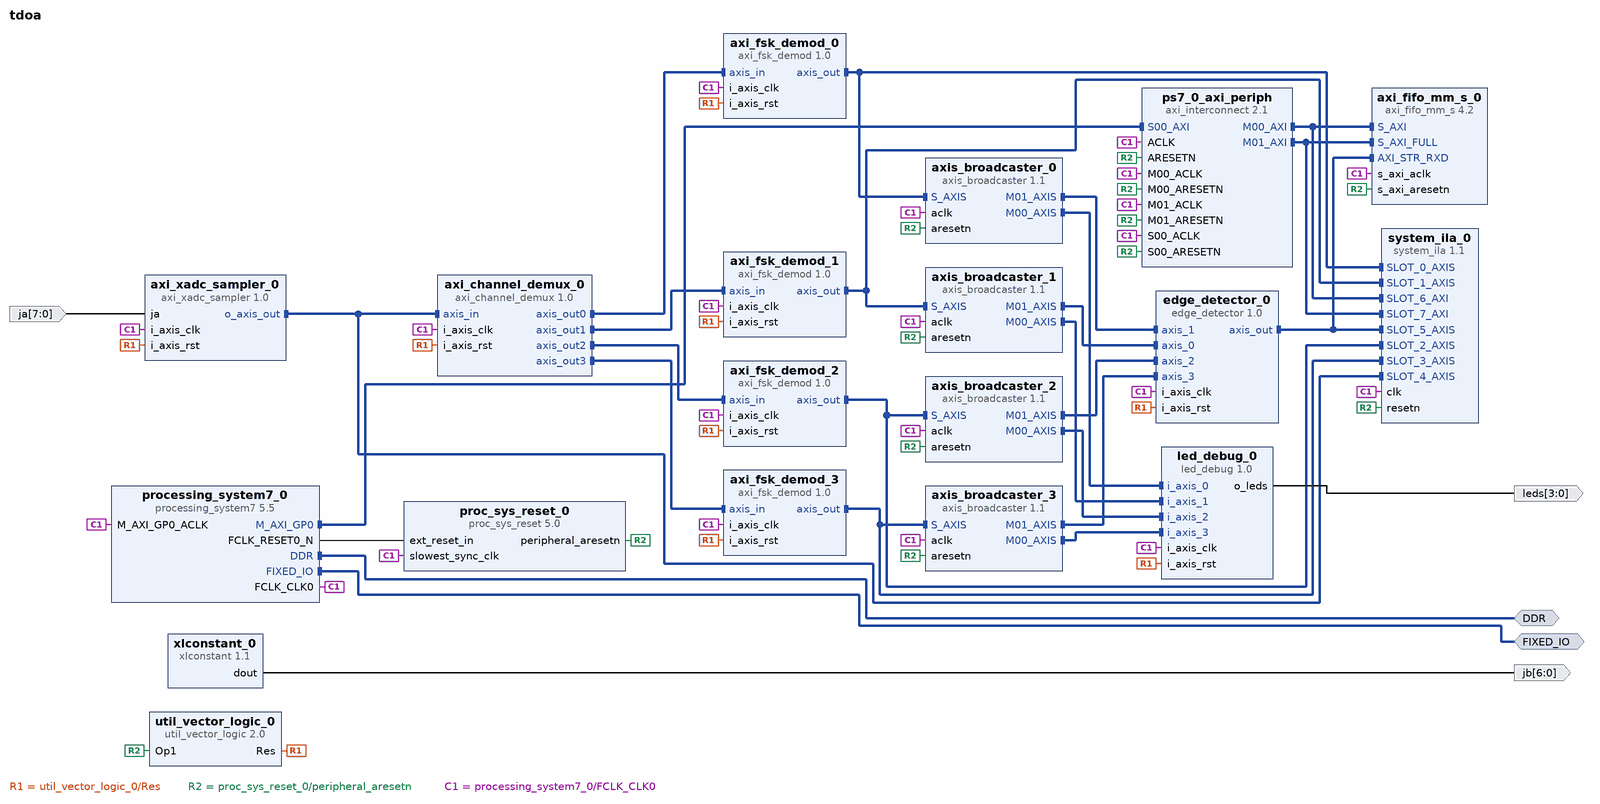
[diagram p0: block diagram of the top level]
# Vivado block design tdoa, xc7z020clg400-1, Vivado 2022.2
create_bd_design tdoa

create_bd_intf_port -mode Master -vlnv xilinx.com:interface:ddrx_rtl:1.0 DDR
create_bd_intf_port -mode Master -vlnv xilinx.com:display_processing_system7:fixedio_rtl:1.0 FIXED_IO
create_bd_port -dir I -from 7 -to 0 ja
create_bd_port -dir O -from 3 -to 0 leds
create_bd_port -dir O -from 6 -to 0 jb

create_bd_cell -type ip -vlnv xilinx.com:ip:processing_system7:5.5 processing_system7_0
set_property -dict [list \
  CONFIG.PCW_APU_PERIPHERAL_FREQMHZ 667 \
  CONFIG.PCW_ENET0_ENET0_IO {MIO 16 .. 27} \
  CONFIG.PCW_ENET0_GRP_MDIO_ENABLE 1 \
  CONFIG.PCW_ENET0_GRP_MDIO_IO {MIO 52 .. 53} \
  CONFIG.PCW_ENET0_PERIPHERAL_ENABLE 1 \
  CONFIG.PCW_ENET0_RESET_ENABLE 0 \
  CONFIG.PCW_ENET_RESET_ENABLE 1 \
  CONFIG.PCW_ENET_RESET_SELECT {Share reset pin} \
  CONFIG.PCW_FPGA0_PERIPHERAL_FREQMHZ 100 \
  CONFIG.PCW_GPIO_MIO_GPIO_ENABLE 1 \
  CONFIG.PCW_GPIO_MIO_GPIO_IO MIO \
  CONFIG.PCW_I2C_RESET_ENABLE 1 \
  CONFIG.PCW_IRQ_F2P_INTR 1 \
  CONFIG.PCW_PRESET_BANK1_VOLTAGE {LVCMOS 1.8V} \
  CONFIG.PCW_QSPI_GRP_FBCLK_ENABLE 1 \
  CONFIG.PCW_QSPI_GRP_FBCLK_IO {MIO 8} \
  CONFIG.PCW_QSPI_GRP_SINGLE_SS_ENABLE 1 \
  CONFIG.PCW_QSPI_GRP_SINGLE_SS_IO {MIO 1 .. 6} \
  CONFIG.PCW_QSPI_PERIPHERAL_ENABLE 1 \
  CONFIG.PCW_QSPI_QSPI_IO {MIO 1 .. 6} \
  CONFIG.PCW_SD0_GRP_CD_ENABLE 1 \
  CONFIG.PCW_SD0_GRP_CD_IO {MIO 47} \
  CONFIG.PCW_SD0_GRP_WP_ENABLE 0 \
  CONFIG.PCW_SD0_PERIPHERAL_ENABLE 1 \
  CONFIG.PCW_SD0_SD0_IO {MIO 40 .. 45} \
  CONFIG.PCW_SDIO_PERIPHERAL_FREQMHZ 50 \
  CONFIG.PCW_SINGLE_QSPI_DATA_MODE x4 \
  CONFIG.PCW_UART1_PERIPHERAL_ENABLE 1 \
  CONFIG.PCW_UART1_UART1_IO {MIO 48 .. 49} \
  CONFIG.PCW_UART_PERIPHERAL_FREQMHZ 100 \
  CONFIG.PCW_UIPARAM_DDR_FREQ_MHZ 533.333333 \
  CONFIG.PCW_UIPARAM_DDR_MEMORY_TYPE {DDR 3 (Low Voltage)} \
  CONFIG.PCW_UIPARAM_DDR_PARTNO {MT41K256M16 RE-125} \
  CONFIG.PCW_USB0_PERIPHERAL_ENABLE 1 \
  CONFIG.PCW_USB0_RESET_ENABLE 1 \
  CONFIG.PCW_USB0_RESET_IO {MIO 46} \
  CONFIG.PCW_USB0_USB0_IO {MIO 28 .. 39} \
  CONFIG.PCW_USB_RESET_ENABLE 1 \
  CONFIG.PCW_USB_RESET_SELECT {Share reset pin} \
  CONFIG.PCW_USE_FABRIC_INTERRUPT 1 \
] [get_bd_cells processing_system7_0]
# 296 more settings of processing_system7_0 are not shown: defaults, MIO pin electricals, DDR timing, and values the tool derives
create_bd_cell -type ip -vlnv user.org:user:axi_channel_demux:1.0 axi_channel_demux_0
create_bd_cell -type ip -vlnv xilinx.com:ip:util_vector_logic:2.0 util_vector_logic_0
set_property -dict {CONFIG.C_OPERATION not CONFIG.C_SIZE 1} [get_bd_cells util_vector_logic_0]
create_bd_cell -type ip -vlnv xilinx.com:ip:proc_sys_reset:5.0 proc_sys_reset_0
create_bd_cell -type ip -vlnv user.org:user:axi_xadc_sampler:1.0 axi_xadc_sampler_0
create_bd_cell -type ip -vlnv xilinx.com:ip:axis_broadcaster:1.1 axis_broadcaster_0
create_bd_cell -type ip -vlnv xilinx.com:ip:axi_fifo_mm_s:4.2 axi_fifo_mm_s_0
set_property -dict [list \
  CONFIG.C_AXIS_TUSER_WIDTH 4 \
  CONFIG.C_DATA_INTERFACE_TYPE 1 \
  CONFIG.C_HAS_AXIS_TDEST false \
  CONFIG.C_RX_FIFO_DEPTH 4096 \
  CONFIG.C_RX_FIFO_PE_THRESHOLD 5 \
  CONFIG.C_RX_FIFO_PF_THRESHOLD 4091 \
  CONFIG.C_S_AXI4_DATA_WIDTH 32 \
  CONFIG.C_USE_RX_CUT_THROUGH true \
  CONFIG.C_USE_TX_CTRL 0 \
  CONFIG.C_USE_TX_DATA 0 \
] [get_bd_cells axi_fifo_mm_s_0]
create_bd_cell -type ip -vlnv xilinx.com:ip:axi_interconnect:2.1 ps7_0_axi_periph
set_property -dict {CONFIG.NUM_MI 2} [get_bd_cells ps7_0_axi_periph]
create_bd_cell -type ip -vlnv xilinx.com:ip:axis_broadcaster:1.1 axis_broadcaster_1
create_bd_cell -type ip -vlnv xilinx.com:ip:axis_broadcaster:1.1 axis_broadcaster_2
create_bd_cell -type ip -vlnv xilinx.com:ip:axis_broadcaster:1.1 axis_broadcaster_3
create_bd_cell -type ip -vlnv xilinx.com:ip:system_ila:1.1 system_ila_0
set_property -dict [list \
  CONFIG.C_MON_TYPE INTERFACE \
  CONFIG.C_NUM_MONITOR_SLOTS 8 \
  CONFIG.C_SLOT_0_APC_EN 0 \
  CONFIG.C_SLOT_0_AXI_DATA_SEL 1 \
  CONFIG.C_SLOT_0_AXI_TRIG_SEL 1 \
  CONFIG.C_SLOT_0_INTF_TYPE xilinx.com:interface:axis_rtl:1.0 \
  CONFIG.C_SLOT_1_APC_EN 0 \
  CONFIG.C_SLOT_1_AXI_DATA_SEL 1 \
  CONFIG.C_SLOT_1_AXI_TRIG_SEL 1 \
  CONFIG.C_SLOT_1_INTF_TYPE xilinx.com:interface:axis_rtl:1.0 \
  CONFIG.C_SLOT_2_APC_EN 0 \
  CONFIG.C_SLOT_2_AXI_DATA_SEL 1 \
  CONFIG.C_SLOT_2_AXI_TRIG_SEL 1 \
  CONFIG.C_SLOT_2_INTF_TYPE xilinx.com:interface:axis_rtl:1.0 \
  CONFIG.C_SLOT_3_APC_EN 0 \
  CONFIG.C_SLOT_3_AXI_DATA_SEL 1 \
  CONFIG.C_SLOT_3_AXI_TRIG_SEL 1 \
  CONFIG.C_SLOT_3_INTF_TYPE xilinx.com:interface:axis_rtl:1.0 \
  CONFIG.C_SLOT_4_APC_EN 0 \
  CONFIG.C_SLOT_4_AXI_DATA_SEL 1 \
  CONFIG.C_SLOT_4_AXI_TRIG_SEL 1 \
  CONFIG.C_SLOT_4_INTF_TYPE xilinx.com:interface:axis_rtl:1.0 \
  CONFIG.C_SLOT_5_APC_EN 0 \
  CONFIG.C_SLOT_5_AXI_DATA_SEL 1 \
  CONFIG.C_SLOT_5_AXI_TRIG_SEL 1 \
  CONFIG.C_SLOT_5_INTF_TYPE xilinx.com:interface:axis_rtl:1.0 \
  CONFIG.C_SLOT_6_APC_EN 0 \
  CONFIG.C_SLOT_6_AXI_AR_SEL_DATA 1 \
  CONFIG.C_SLOT_6_AXI_AR_SEL_TRIG 1 \
  CONFIG.C_SLOT_6_AXI_AW_SEL_DATA 1 \
  CONFIG.C_SLOT_6_AXI_AW_SEL_TRIG 1 \
  CONFIG.C_SLOT_6_AXI_B_SEL_DATA 1 \
  CONFIG.C_SLOT_6_AXI_B_SEL_TRIG 1 \
  CONFIG.C_SLOT_6_AXI_R_SEL_DATA 1 \
  CONFIG.C_SLOT_6_AXI_R_SEL_TRIG 1 \
  CONFIG.C_SLOT_6_AXI_W_SEL_DATA 1 \
  CONFIG.C_SLOT_6_AXI_W_SEL_TRIG 1 \
  CONFIG.C_SLOT_6_INTF_TYPE xilinx.com:interface:aximm_rtl:1.0 \
  CONFIG.C_SLOT_7_APC_EN 0 \
  CONFIG.C_SLOT_7_AXI_AR_SEL_DATA 1 \
  CONFIG.C_SLOT_7_AXI_AR_SEL_TRIG 1 \
  CONFIG.C_SLOT_7_AXI_AW_SEL_DATA 0 \
  CONFIG.C_SLOT_7_AXI_AW_SEL_TRIG 0 \
  CONFIG.C_SLOT_7_AXI_B_SEL_DATA 0 \
  CONFIG.C_SLOT_7_AXI_B_SEL_TRIG 0 \
  CONFIG.C_SLOT_7_AXI_R_SEL_DATA 1 \
  CONFIG.C_SLOT_7_AXI_R_SEL_TRIG 1 \
  CONFIG.C_SLOT_7_AXI_W_SEL_DATA 0 \
  CONFIG.C_SLOT_7_AXI_W_SEL_TRIG 0 \
  CONFIG.C_SLOT_7_INTF_TYPE xilinx.com:interface:aximm_rtl:1.0 \
] [get_bd_cells system_ila_0]
create_bd_cell -type ip -vlnv xilinx.com:ip:xlconstant:1.1 xlconstant_0
set_property -dict {CONFIG.CONST_VAL -1 CONFIG.CONST_WIDTH 7} [get_bd_cells xlconstant_0]
create_bd_cell -type ip -vlnv user.org:user:axi_fsk_demod:1.0 axi_fsk_demod_0
set_property -dict [list \
  CONFIG.COEFF_A 620 \
  CONFIG.COEFF_B_HI_IM_0 999 \
  CONFIG.COEFF_B_HI_IM_1 996 \
  CONFIG.COEFF_B_HI_IM_2 993 \
  CONFIG.COEFF_B_HI_RE_0 -216 \
  CONFIG.COEFF_B_HI_RE_1 -229 \
  CONFIG.COEFF_B_HI_RE_2 -241 \
  CONFIG.COEFF_B_LO_IM_0 1021 \
  CONFIG.COEFF_B_LO_IM_1 1020 \
  CONFIG.COEFF_B_LO_IM_2 1020 \
  CONFIG.COEFF_B_LO_RE_0 -51 \
  CONFIG.COEFF_B_LO_RE_1 -64 \
  CONFIG.COEFF_B_LO_RE_2 -77 \
  CONFIG.N 500 \
] [get_bd_cells axi_fsk_demod_0]
create_bd_cell -type ip -vlnv user.org:user:axi_fsk_demod:1.0 axi_fsk_demod_1
set_property -dict [list \
  CONFIG.COEFF_A 620 \
  CONFIG.COEFF_B_HI_IM_0 999 \
  CONFIG.COEFF_B_HI_IM_1 996 \
  CONFIG.COEFF_B_HI_IM_2 993 \
  CONFIG.COEFF_B_HI_RE_0 -216 \
  CONFIG.COEFF_B_HI_RE_1 -229 \
  CONFIG.COEFF_B_HI_RE_2 -241 \
  CONFIG.COEFF_B_LO_IM_0 1021 \
  CONFIG.COEFF_B_LO_IM_1 1020 \
  CONFIG.COEFF_B_LO_IM_2 1020 \
  CONFIG.COEFF_B_LO_RE_0 -51 \
  CONFIG.COEFF_B_LO_RE_1 -64 \
  CONFIG.COEFF_B_LO_RE_2 -77 \
  CONFIG.N 500 \
] [get_bd_cells axi_fsk_demod_1]
create_bd_cell -type ip -vlnv user.org:user:axi_fsk_demod:1.0 axi_fsk_demod_2
set_property -dict [list \
  CONFIG.COEFF_A 620 \
  CONFIG.COEFF_B_HI_IM_0 999 \
  CONFIG.COEFF_B_HI_IM_1 996 \
  CONFIG.COEFF_B_HI_IM_2 993 \
  CONFIG.COEFF_B_HI_RE_0 -216 \
  CONFIG.COEFF_B_HI_RE_1 -229 \
  CONFIG.COEFF_B_HI_RE_2 -241 \
  CONFIG.COEFF_B_LO_IM_0 1021 \
  CONFIG.COEFF_B_LO_IM_1 1020 \
  CONFIG.COEFF_B_LO_IM_2 1020 \
  CONFIG.COEFF_B_LO_RE_0 -51 \
  CONFIG.COEFF_B_LO_RE_1 -64 \
  CONFIG.COEFF_B_LO_RE_2 -77 \
  CONFIG.N 500 \
] [get_bd_cells axi_fsk_demod_2]
create_bd_cell -type ip -vlnv user.org:user:axi_fsk_demod:1.0 axi_fsk_demod_3
set_property -dict [list \
  CONFIG.COEFF_A 620 \
  CONFIG.COEFF_B_HI_IM_0 999 \
  CONFIG.COEFF_B_HI_IM_1 996 \
  CONFIG.COEFF_B_HI_IM_2 993 \
  CONFIG.COEFF_B_HI_RE_0 -216 \
  CONFIG.COEFF_B_HI_RE_1 -229 \
  CONFIG.COEFF_B_HI_RE_2 -241 \
  CONFIG.COEFF_B_LO_IM_0 1021 \
  CONFIG.COEFF_B_LO_IM_1 1020 \
  CONFIG.COEFF_B_LO_IM_2 1020 \
  CONFIG.COEFF_B_LO_RE_0 -51 \
  CONFIG.COEFF_B_LO_RE_1 -64 \
  CONFIG.COEFF_B_LO_RE_2 -77 \
  CONFIG.N 500 \
] [get_bd_cells axi_fsk_demod_3]
create_bd_cell -type ip -vlnv user.org:user:edge_detector:1.0 edge_detector_0
create_bd_cell -type ip -vlnv user.org:user:led_debug:1.0 led_debug_0

# ---- connections ----

connect_bd_intf_net [get_bd_intf_pins axi_channel_demux_0/axis_out0] [get_bd_intf_pins axi_fsk_demod_0/axis_in]
connect_bd_intf_net [get_bd_intf_pins axi_channel_demux_0/axis_out1] [get_bd_intf_pins axi_fsk_demod_1/axis_in]
connect_bd_intf_net [get_bd_intf_pins axi_channel_demux_0/axis_out2] [get_bd_intf_pins axi_fsk_demod_2/axis_in]
connect_bd_intf_net [get_bd_intf_pins axi_channel_demux_0/axis_out3] [get_bd_intf_pins axi_fsk_demod_3/axis_in]
connect_bd_intf_net -intf_net axi_fsk_demod_0_axis_out [get_bd_intf_pins axi_fsk_demod_0/axis_out] [get_bd_intf_pins axis_broadcaster_0/S_AXIS]
connect_bd_intf_net [get_bd_intf_pins axi_fsk_demod_0/axis_out] [get_bd_intf_pins system_ila_0/SLOT_0_AXIS]
connect_bd_intf_net -intf_net axi_fsk_demod_1_axis_out [get_bd_intf_pins axi_fsk_demod_1/axis_out] [get_bd_intf_pins axis_broadcaster_1/S_AXIS]
connect_bd_intf_net [get_bd_intf_pins axi_fsk_demod_1/axis_out] [get_bd_intf_pins system_ila_0/SLOT_1_AXIS]
connect_bd_intf_net -intf_net axi_fsk_demod_2_axis_out [get_bd_intf_pins axi_fsk_demod_2/axis_out] [get_bd_intf_pins axis_broadcaster_2/S_AXIS]
connect_bd_intf_net [get_bd_intf_pins axi_fsk_demod_2/axis_out] [get_bd_intf_pins system_ila_0/SLOT_2_AXIS]
connect_bd_intf_net -intf_net axi_fsk_demod_3_axis_out [get_bd_intf_pins axi_fsk_demod_3/axis_out] [get_bd_intf_pins axis_broadcaster_3/S_AXIS]
connect_bd_intf_net [get_bd_intf_pins axi_fsk_demod_3/axis_out] [get_bd_intf_pins system_ila_0/SLOT_3_AXIS]
connect_bd_intf_net -intf_net axi_xadc_sampler_0_o_axis_out [get_bd_intf_pins axi_xadc_sampler_0/o_axis_out] [get_bd_intf_pins axi_channel_demux_0/axis_in]
connect_bd_intf_net [get_bd_intf_pins axi_xadc_sampler_0/o_axis_out] [get_bd_intf_pins system_ila_0/SLOT_4_AXIS]
connect_bd_intf_net [get_bd_intf_pins axis_broadcaster_0/M00_AXIS] [get_bd_intf_pins led_debug_0/i_axis_0]
connect_bd_intf_net [get_bd_intf_pins axis_broadcaster_0/M01_AXIS] [get_bd_intf_pins edge_detector_0/axis_1]
connect_bd_intf_net [get_bd_intf_pins axis_broadcaster_1/M00_AXIS] [get_bd_intf_pins led_debug_0/i_axis_1]
connect_bd_intf_net [get_bd_intf_pins axis_broadcaster_1/M01_AXIS] [get_bd_intf_pins edge_detector_0/axis_0]
connect_bd_intf_net [get_bd_intf_pins axis_broadcaster_2/M00_AXIS] [get_bd_intf_pins led_debug_0/i_axis_2]
connect_bd_intf_net [get_bd_intf_pins axis_broadcaster_2/M01_AXIS] [get_bd_intf_pins edge_detector_0/axis_2]
connect_bd_intf_net [get_bd_intf_pins axis_broadcaster_3/M00_AXIS] [get_bd_intf_pins led_debug_0/i_axis_3]
connect_bd_intf_net [get_bd_intf_pins axis_broadcaster_3/M01_AXIS] [get_bd_intf_pins edge_detector_0/axis_3]
connect_bd_intf_net -intf_net edge_detector_0_axis_out [get_bd_intf_pins edge_detector_0/axis_out] [get_bd_intf_pins axi_fifo_mm_s_0/AXI_STR_RXD]
connect_bd_intf_net [get_bd_intf_pins edge_detector_0/axis_out] [get_bd_intf_pins system_ila_0/SLOT_5_AXIS]
connect_bd_intf_net [get_bd_intf_ports DDR] [get_bd_intf_pins processing_system7_0/DDR]
connect_bd_intf_net [get_bd_intf_ports FIXED_IO] [get_bd_intf_pins processing_system7_0/FIXED_IO]
connect_bd_intf_net [get_bd_intf_pins processing_system7_0/M_AXI_GP0] [get_bd_intf_pins ps7_0_axi_periph/S00_AXI]
connect_bd_intf_net -intf_net ps7_0_axi_periph_M00_AXI [get_bd_intf_pins ps7_0_axi_periph/M00_AXI] [get_bd_intf_pins axi_fifo_mm_s_0/S_AXI]
connect_bd_intf_net [get_bd_intf_pins ps7_0_axi_periph/M00_AXI] [get_bd_intf_pins system_ila_0/SLOT_6_AXI]
connect_bd_intf_net -intf_net ps7_0_axi_periph_M01_AXI [get_bd_intf_pins ps7_0_axi_periph/M01_AXI] [get_bd_intf_pins axi_fifo_mm_s_0/S_AXI_FULL]
connect_bd_intf_net [get_bd_intf_pins ps7_0_axi_periph/M01_AXI] [get_bd_intf_pins system_ila_0/SLOT_7_AXI]
connect_bd_net -net ja_0_1 [get_bd_ports ja] [get_bd_pins axi_xadc_sampler_0/ja]
connect_bd_net [get_bd_pins led_debug_0/o_leds] [get_bd_ports leds]
connect_bd_net -net proc_sys_reset_0_peripheral_aresetn [get_bd_pins util_vector_logic_0/Res] \
  [get_bd_pins axi_channel_demux_0/i_axis_rst] [get_bd_pins axi_xadc_sampler_0/i_axis_rst] \
  [get_bd_pins axi_fsk_demod_0/i_axis_rst] [get_bd_pins axi_fsk_demod_1/i_axis_rst] [get_bd_pins axi_fsk_demod_2/i_axis_rst] \
  [get_bd_pins axi_fsk_demod_3/i_axis_rst] [get_bd_pins edge_detector_0/i_axis_rst] [get_bd_pins led_debug_0/i_axis_rst]
connect_bd_net [get_bd_pins proc_sys_reset_0/peripheral_aresetn] \
  [get_bd_pins util_vector_logic_0/Op1] [get_bd_pins axis_broadcaster_0/aresetn] [get_bd_pins ps7_0_axi_periph/S00_ARESETN] \
  [get_bd_pins axi_fifo_mm_s_0/s_axi_aresetn] [get_bd_pins ps7_0_axi_periph/M00_ARESETN] \
  [get_bd_pins ps7_0_axi_periph/ARESETN] [get_bd_pins ps7_0_axi_periph/M01_ARESETN] [get_bd_pins axis_broadcaster_1/aresetn] \
  [get_bd_pins axis_broadcaster_3/aresetn] [get_bd_pins axis_broadcaster_2/aresetn] [get_bd_pins system_ila_0/resetn]
connect_bd_net [get_bd_pins processing_system7_0/FCLK_CLK0] \
  [get_bd_pins axi_channel_demux_0/i_axis_clk] [get_bd_pins processing_system7_0/M_AXI_GP0_ACLK] \
  [get_bd_pins proc_sys_reset_0/slowest_sync_clk] [get_bd_pins axi_xadc_sampler_0/i_axis_clk] \
  [get_bd_pins axis_broadcaster_0/aclk] [get_bd_pins ps7_0_axi_periph/S00_ACLK] [get_bd_pins axi_fifo_mm_s_0/s_axi_aclk] \
  [get_bd_pins ps7_0_axi_periph/M00_ACLK] [get_bd_pins ps7_0_axi_periph/ACLK] [get_bd_pins ps7_0_axi_periph/M01_ACLK] \
  [get_bd_pins axis_broadcaster_3/aclk] [get_bd_pins axis_broadcaster_2/aclk] [get_bd_pins axis_broadcaster_1/aclk] \
  [get_bd_pins system_ila_0/clk] [get_bd_pins axi_fsk_demod_0/i_axis_clk] [get_bd_pins axi_fsk_demod_3/i_axis_clk] \
  [get_bd_pins axi_fsk_demod_2/i_axis_clk] [get_bd_pins axi_fsk_demod_1/i_axis_clk] [get_bd_pins edge_detector_0/i_axis_clk] \
  [get_bd_pins led_debug_0/i_axis_clk]
connect_bd_net [get_bd_pins processing_system7_0/FCLK_RESET0_N] [get_bd_pins proc_sys_reset_0/ext_reset_in]
connect_bd_net [get_bd_pins xlconstant_0/dout] [get_bd_ports jb]
set_property HDL_ATTRIBUTE.DEBUG true [get_bd_intf_nets axi_fsk_demod_0_axis_out]
set_property HDL_ATTRIBUTE.MARK_DEBUG true [get_bd_intf_nets axi_fsk_demod_0_axis_out]
set_property HDL_ATTRIBUTE.DEBUG true [get_bd_intf_nets axi_fsk_demod_1_axis_out]
set_property HDL_ATTRIBUTE.MARK_DEBUG true [get_bd_intf_nets axi_fsk_demod_1_axis_out]
set_property HDL_ATTRIBUTE.DEBUG true [get_bd_intf_nets axi_fsk_demod_2_axis_out]
set_property HDL_ATTRIBUTE.MARK_DEBUG true [get_bd_intf_nets axi_fsk_demod_2_axis_out]
set_property HDL_ATTRIBUTE.DEBUG true [get_bd_intf_nets axi_fsk_demod_3_axis_out]
set_property HDL_ATTRIBUTE.MARK_DEBUG true [get_bd_intf_nets axi_fsk_demod_3_axis_out]
set_property HDL_ATTRIBUTE.DEBUG true [get_bd_intf_nets axi_xadc_sampler_0_o_axis_out]
set_property HDL_ATTRIBUTE.MARK_DEBUG true [get_bd_intf_nets axi_xadc_sampler_0_o_axis_out]
set_property HDL_ATTRIBUTE.DEBUG true [get_bd_intf_nets edge_detector_0_axis_out]
set_property HDL_ATTRIBUTE.MARK_DEBUG true [get_bd_intf_nets edge_detector_0_axis_out]
set_property HDL_ATTRIBUTE.DEBUG true [get_bd_intf_nets ps7_0_axi_periph_M00_AXI]
set_property HDL_ATTRIBUTE.MARK_DEBUG true [get_bd_intf_nets ps7_0_axi_periph_M00_AXI]
set_property HDL_ATTRIBUTE.DEBUG true [get_bd_intf_nets ps7_0_axi_periph_M01_AXI]
set_property HDL_ATTRIBUTE.MARK_DEBUG true [get_bd_intf_nets ps7_0_axi_periph_M01_AXI]

# ---- address map ----
assign_bd_address -offset 0x43C00000 -range 64K -target_address_space [get_bd_addr_spaces processing_system7_0/Data] [get_bd_addr_segs axi_fifo_mm_s_0/S_AXI/Mem0]
assign_bd_address -offset 0x43C10000 -range 64K -target_address_space [get_bd_addr_spaces processing_system7_0/Data] [get_bd_addr_segs axi_fifo_mm_s_0/S_AXI_FULL/Mem1]

validate_bd_design
save_bd_design
